# EAGLE design Escon_backboard (EAGLE 9.6.2)
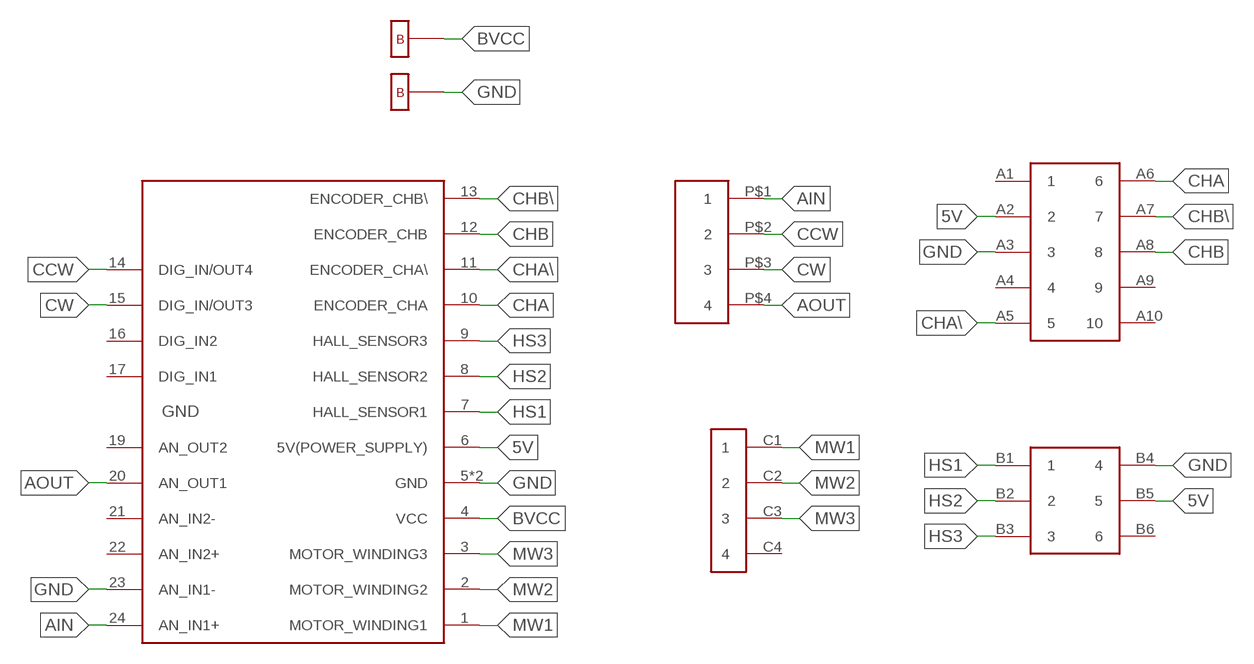
[diagram p0: schematic, sheet 1]

## Parts
U$1  ESCON24/224/2  [ESCON24/2]
U$2  280378-2CONNECTOR  [280378-2CONNECTOR]
U$3  PIN2.54-2X5  [PIN2.54-2X5]
U$4  MX-44914-0601  [MX-44914-0601]
U$5  MX5566  [MX5566]
U$6  BHOLE  [BHOLE]
U$7  BHOLE  [BHOLE]

## Nets
5V: U$1.6(5V(POWER_SUPPLY)) U$3.A2 U$4.B5
AIN: U$1.24(AN_IN1+) U$2.P$1
AOUT: U$1.20(AN_OUT1) U$2.P$4
BVCC: U$1.4(VCC) U$6.P$1
CCW: U$1.14(DIG_IN/OUT4) U$2.P$2
CHA: U$1.10(ENCODER_CHA) U$3.A6
CHA\\: U$1.11(ENCODER_CHA\\) U$3.A5
CHB: U$1.12(ENCODER_CHB) U$3.A8
CHB\\: U$1.13(ENCODER_CHB\\) U$3.A7
CW: U$1.15(DIG_IN/OUT3) U$2.P$3
GND: U$1.5(GND) U$1.18(GND) U$1.23(AN_IN1-) U$3.A3 U$4.B4 U$7.P$1
HS1: U$1.7(HALL_SENSOR1) U$4.B1
HS2: U$1.8(HALL_SENSOR2) U$4.B2
HS3: U$1.9(HALL_SENSOR3) U$4.B3
MW1: U$1.1(MOTOR_WINDING1) U$5.C1
MW2: U$1.2(MOTOR_WINDING2) U$5.C2
MW3: U$1.3(MOTOR_WINDING3) U$5.C3
Unconnected: U$1.16(DIG_IN2) U$1.17(DIG_IN1) U$1.19(AN_OUT2) U$1.21(AN_IN2-) U$1.22(AN_IN2+) U$3.A1 U$3.A4 U$3.A9 U$3.A10 U$4.B6 U$5.C4

## Library data of the parts
U$1 = ESCON_24-2:ESCON24/2
U$2 = 280378-2CONNECTOR:280378-2CONNECTOR: Signal connector: Male and Female connectors can be purchased at TME: https://www.tme.eu/gb/details/280378-2/raster-signal-connectors-2-54mm/te-connectivity/ https://www.tme.eu/gb/details/280359/raster-signal-connectors-2-54mm/te-connectivity/
U$3 = PIN2.54-2X5:PIN2.54-2X5: Connector for EC-FLAT45(encoder): Can be bought at gme.sk: https://www.gme.sk/v/1498388/kls-mlw10g-konektor-vidlice-roztec-254mm-2x5pinov-priama-do-dps
U$4 = MX-44914-0601:MX-44914-0601: Connector for EC-FLAT45(hall sensor): Can be bought trough tme.eu: https://www.tme.eu/gb/details/mx-44914-0601/other-connectors-molex/molex/449140601/
U$5 = MX5566:MX5566: Connector for EC-FLAT45(motor windings): Can be bought on gme.sk: https://www.gme.sk/v/1496575/molex-39-28-1043-mini-fit-vidlica-rozstup-42mm-2x2piny-priama-do-dps
U$6 U$7 = BATTERY_PIN:BHOLE

## Board
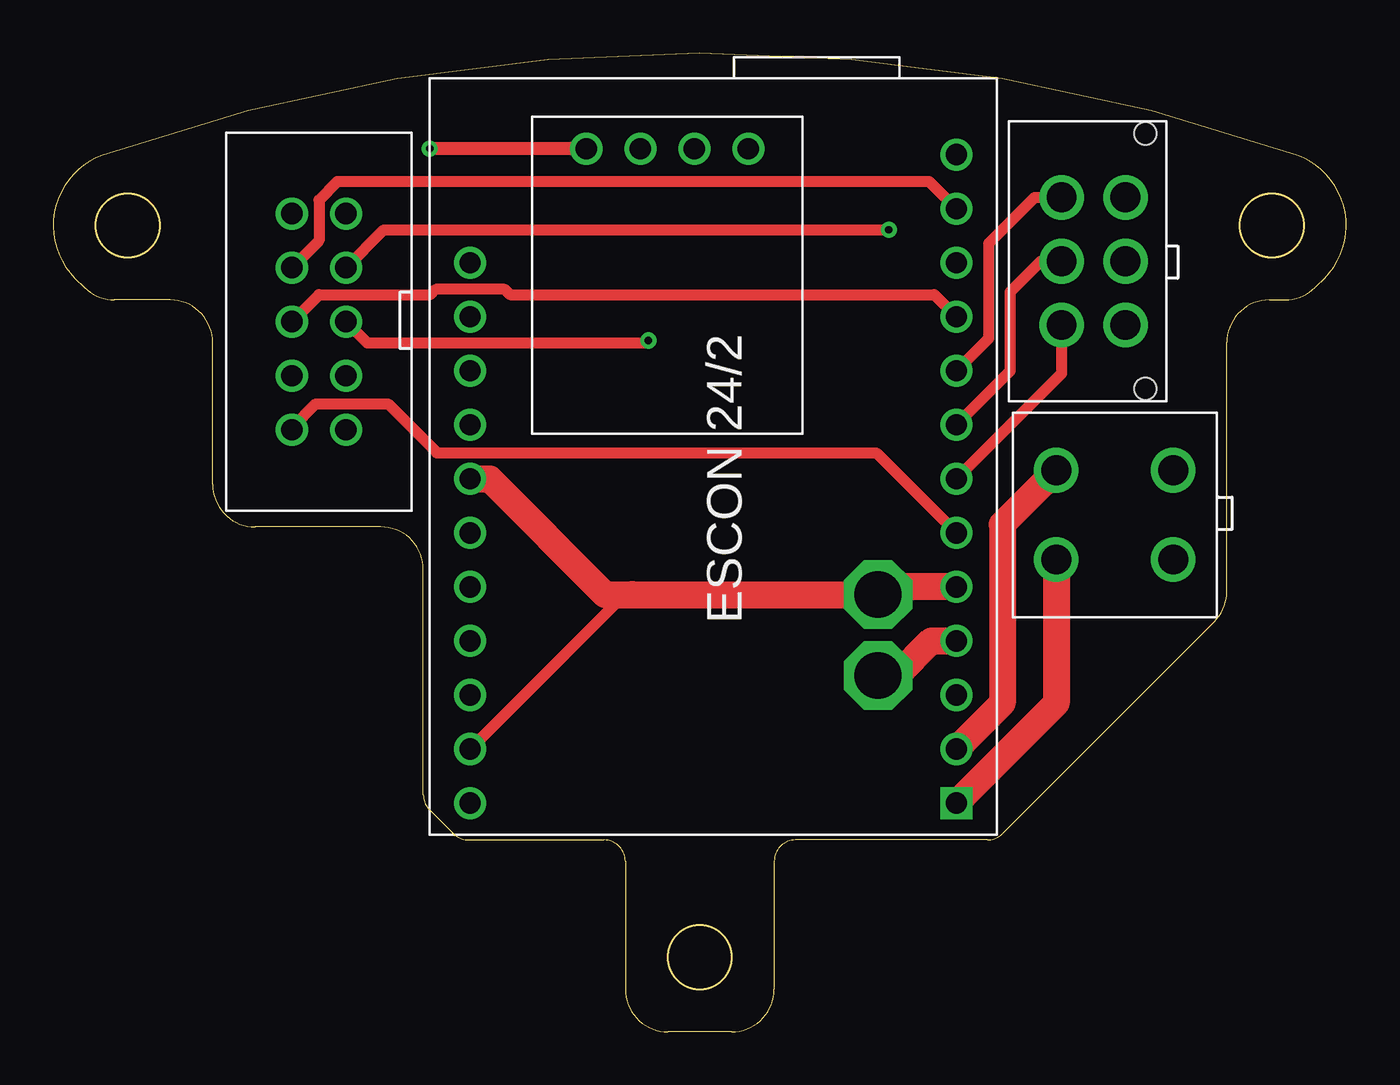
[diagram p1: board, top side]
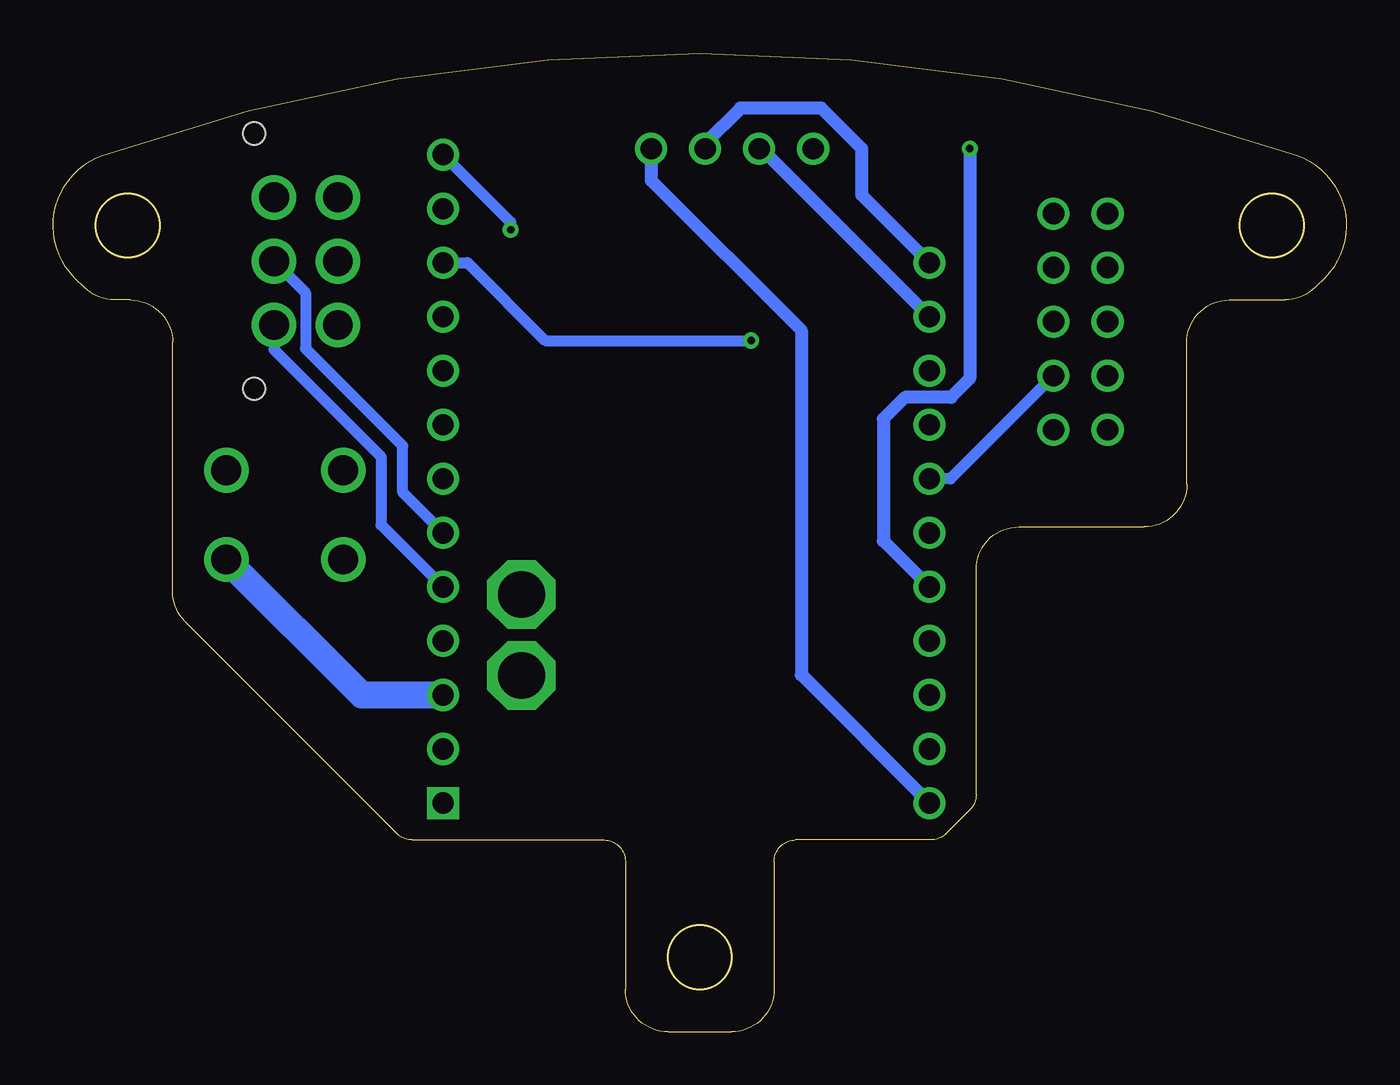
[diagram p2: board, bottom side, seen from below]

Size 60.81 x 46 mm. Coordinates in mm from the lower left corner, seen from the top.
Outline: 26.9,8.02 26.9,2 arc90 28.9,0 31.9,0 arc90 33.9,2 33.9,8.02 arc-90 34.9,9.02 43.92,9.02 arc45 44.63,9.31 54.6,19.28 arc45 55.19,20.7 55.19,32.4 arc-90 57.19,34.4 57.93,34.4 arc45 59.34,34.99 59.78,35.43 arc116 58.47,41.2 arc39 2.34,41.2 arc116 1.02,35.43 1.46,34.99 arc45 2.88,34.4 5.5,34.4 arc-90 7.5,32.4 7.5,25.73 arc90 9.5,23.73 15.4,23.73 arc-90 17.4,21.73 17.4,11.15 arc45 17.7,10.44 18.83,9.31 arc45 19.54,9.02 25.9,9.02 arc-90 26.9,8.02
Outline: circle at 3.5,37.9 radius 1.5
Outline: circle at 57.31,37.9 radius 1.5
Outline: circle at 30.4,3.5 radius 1.5
Copper layers (1*16): Top 0.035mm / dielectric 1.5mm / Bottom 0.035mm
Design rules "default": minimum track width 6mil, minimum drill 0.35mm, track to track 6mil, track to pad 6mil, pad to pad 6mil, via to via 6mil, smd to smd 6mil, copper to edge 40mil, drill to drill 6mil, minimum pad ring 10mil, minimum via ring 8mil, stop-mask expansion 4mil, vias tented up to drill 0mil, thermal gap 10mil
Holes 1.04 mm at 51.36,42.22 51.36,30.22

### Footprints (pad centres in the part's own frame; a part is rotated, then mirrored left to right if it is on the bottom)
ESCON24/2 = drill 1 square: 1 34.06,24.765 | drill 1: 2 31.52,24.765; 3 28.98,24.765; 4 26.44,24.765; 5 23.9,24.765; 6 21.36,24.765; 7 18.82,24.765; 8 16.28,24.765; 9 13.74,24.765; 10 11.2,24.765; 11 8.66,24.765; 12 6.12,24.765; 13 3.58,24.765; 14 8.66,1.905; 15 11.2,1.905; 16 13.74,1.905; 17 16.28,1.905; 18 18.82,1.905; 19 21.36,1.905; 20 23.9,1.905; 21 26.44,1.905; 22 28.98,1.905; 23 31.52,1.905; 24 34.06,1.905
280378-2CONNECTOR = drill 1: P$1 0,0; P$2 2.54,0; P$3 5.08,0; P$4 7.62,0
PIN2.54-2X5 = drill 1: A1 0,0; A2 0,2.54; A3 2.54,0; A4 2.54,2.54; A5 5.08,0; A6 5.08,2.54; A7 7.62,0; A8 7.62,2.54; A9 10.16,0; A10 10.16,2.54
MX-44914-0601 = drill 1.4: B1 6,0; B2 3,0; B3 0,0; B4 6,3; B5 3,3; B6 0,3 | hole 1.04: -3,3.94; 9,3.94
MX5566 = drill 1.4: C1 4.2,0; C2 0,0; C3 4.2,5.5; C4 0,5.5
BHOLE = drill 2.2 octagon: P$1 0,0

### Placement (x,y rotation side)
U$1  17.7,44.81 270 top
U$2  32.69,41.51 180 top
U$3  13.77,28.3 90 top
U$4  47.42,39.22 270 top
U$5  47.17,26.4 270 top
U$6  38.79,16.74 0 top
U$7  38.79,20.55 0 top

### Tracks (layer width: path | path; a pad name or v marks a point on that pad's centre or on a via)
5V
  Top 0.508: U$3.A2 11.23,28.39 12.35,29.52 15.74,29.52 18.04,27.22 38.71,27.22 U$1.6
  Bottom 0.508: U$1.6 44.37,25.36 44.37,27.54 48.95,32.11 48.95,34.75 U$4.B5
AIN
  Bottom 0.61: U$2.P$1 32.69,40.02 25.63,32.97 25.63,16.77 U$1.24
AOUT  (via drill 0.35)
  Top 0.61: U$2.P$4 v17.7,41.51
  Bottom 0.61: v17.7,41.51 17.7,30.72 18.59,29.83 20.75,29.83 21.77,28.81 21.77,23.07 U$1.20
BVCC
  Top 1.27: U$6.P$1 39.67,16.74 41.3,18.37 U$1.4
CCW
  Bottom 0.61: U$1.14 22.78,39.33 22.78,41.51 24.69,43.42 28.5,43.42 30.15,41.76 U$2.P$2
CHA
  Top 0.508: U$3.A6 12.5,34.65 17.74,34.65 17.98,34.9 21.23,34.9 21.48,34.65 41.43,34.65 U$1.10
CHA\\  (via drill 0.35)
  Top 0.508: v27.99,32.49 27.86,32.37 14.78,32.37 U$3.A5
  Bottom 0.508: U$1.11 41.33,36.15 37.67,32.49 v27.99,32.49
CHB
  Top 0.508: U$3.A8 12.5,37.19 12.5,39.1 13.36,39.96 41.2,39.96 U$1.12
CHB\\  (via drill 0.35)
  Top 0.508: U$3.A7 15.54,37.7 v39.29,37.7
  Bottom 0.508: v39.29,37.7 39.29,38.06 U$1.13
CW
  Bottom 0.61: U$1.15 27.51,41.51 U$2.P$3
GND
  Top 0.508: U$1.23 26.87,20.55 27.23,20.55
  Top 1.27: U$1.5 39.14,20.91 U$7.P$1 27.23,20.55 25.96,20.55 20.52,25.99 U$1.18
  Bottom 0.508: U$3.A3 18.62,25.99 U$1.18 | U$4.B4 50.42,32.06 45.39,27.03 45.39,23.83 U$1.5
HS1
  Top 0.508: U$1.7 47.42,30.94 U$4.B1
HS2
  Top 0.508: U$1.8 45.01,31.07 45.01,34.78 46.45,36.22 U$4.B2
HS3
  Top 0.508: U$1.9 43.99,32.6 43.99,37.06 46.15,39.22 U$4.B3
MW1
  Top 1.27: U$5.C1 47.17,15.45 U$1.1
MW2
  Top 1.27: U$5.C2 44.63,23.86 44.63,15.45 U$1.2
MW3
  Bottom 1.27: U$5.C3 46.3,15.83 U$1.3